# Altium schematic sheet JTAG2.SchDoc: Animated Archer Main PCB
size Letter; Author: John Eric Martin; Engineer: John Eric Martin; Organization: UCCS IEEE Robotics; Address1: 1420 Austin Bluffs Pkwy; Address2: Colorado Springs, CO 80918; DocumentNumber: JTAG2; Revision: 1; SheetNumber: 8; SheetTotal: 10; ProjectName: Animated Archer Quadcopter
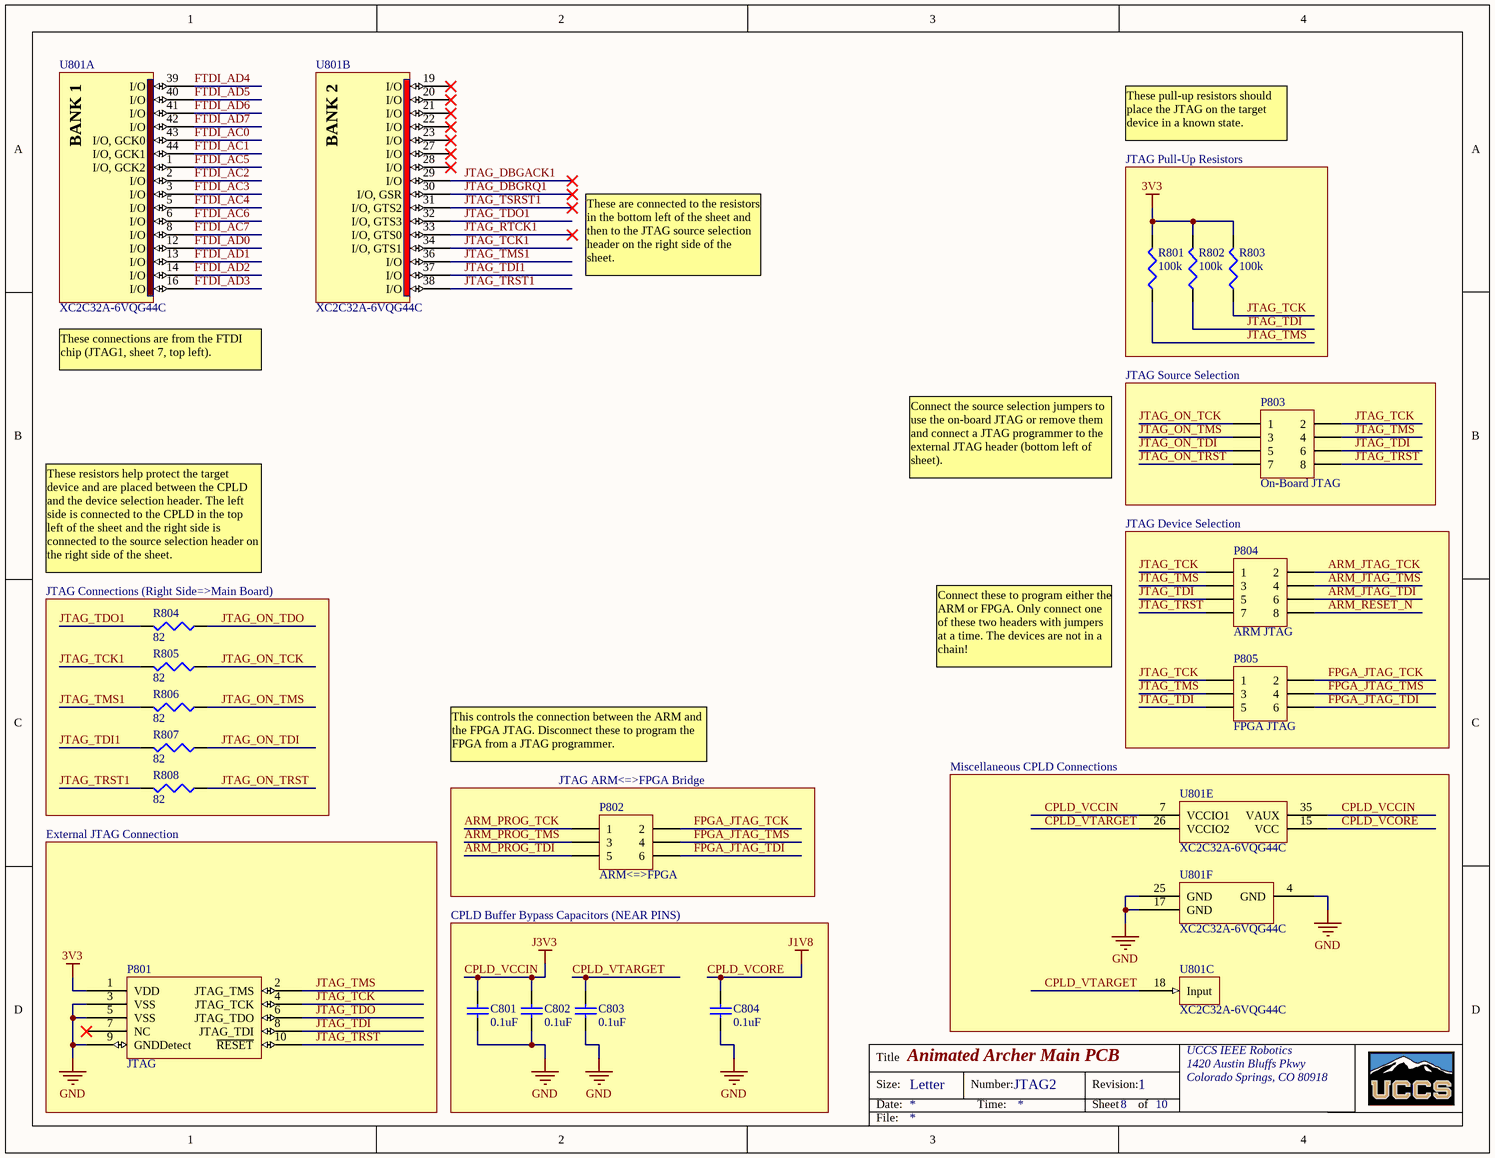
[diagram p0: JTAG2.SchDoc]

## Parts
C801  0.1uF  [1608[0603]]
C802  0.1uF  [1608[0603]]
C803  0.1uF  [1608[0603]]
C804  0.1uF  [1608[0603]]
P801  JTAG  [EZPORT]
P802  ARM<=>FPGA  [HDR2X3]
P803  On-Board JTAG  [HDR2X4]
P804  ARM JTAG  [HDR2X4]
P805  FPGA JTAG  [HDR2X3]
R801  value 100k  [J1-0603]  (hidden comment: Res3)
R802  value 100k  [J1-0603]  (hidden comment: Res3)
R803  value 100k  [J1-0603]  (hidden comment: Res3)
R804  value 82  [J1-0603]  (hidden comment: Res3)
R805  value 82  [J1-0603]  (hidden comment: Res3)
R806  value 82  [J1-0603]  (hidden comment: Res3)
R807  value 82  [J1-0603]  (hidden comment: Res3)
R808  value 82  [J1-0603]  (hidden comment: Res3)
U801  XC2C32A-6VQG44C  [VQG44_N]  (parts A,B,C,E,F of 6)

## Blocks framed on the sheet
JTAG Pull-Up Resistors: R801-R803
JTAG Source Selection: P803
JTAG Device Selection: P804 P805
JTAG Connections (Right Side=>Main Board): R804-R808
JTAG ARM<=>FPGA Bridge: P802
Miscellaneous CPLD Connections: U801
External JTAG Connection: P801
CPLD Buffer Bypass Capacitors (NEAR PINS): C801-C804

## Nets
3V3: P801.1(VDD) R801.2 R802.2 R803.2
CPLD_VCCIN: C801.2 C802.2 U801.7(VCCIO1) U801.35(VAUX)  [also labelled J3V3]
CPLD_VCORE: C804.2 U801.15(VCC)  [also labelled J1V8]
GND: C801.1 C802.1 C803.1 C804.1 P801.3(VSS) P801.5(VSS) P801.9(GNDDetect) U801.4(GND) U801.17(GND) U801.25(GND)
ARM_JTAG_TCK: P804.2
ARM_JTAG_TDI: P804.6
ARM_JTAG_TMS: P804.4
ARM_PROG_TCK: P802.1
ARM_PROG_TDI: P802.5
ARM_PROG_TMS: P802.3
ARM_RESET_N: P804.8
CPLD_VTARGET: C803.2 U801.18(Input) U801.26(VCCIO2)
FPGA_JTAG_TCK: P802.2 P805.2
FPGA_JTAG_TDI: P802.6 P805.6
FPGA_JTAG_TMS: P802.4 P805.4
FTDI_AC0: U801.43(I/O,_GCK0)
FTDI_AC1: U801.44(I/O,_GCK1)
FTDI_AC2: U801.2(I/O)
FTDI_AC3: U801.3(I/O)
FTDI_AC4: U801.5(I/O)
FTDI_AC5: U801.1(I/O,_GCK2)
FTDI_AC6: U801.6(I/O)
FTDI_AC7: U801.8(I/O)
FTDI_AD0: U801.12(I/O)
FTDI_AD1: U801.13(I/O)
FTDI_AD2: U801.14(I/O)
FTDI_AD3: U801.16(I/O)
FTDI_AD4: U801.39(I/O)
FTDI_AD5: U801.40(I/O)
FTDI_AD6: U801.41(I/O)
FTDI_AD7: U801.42(I/O)
JTAG_DBGACK1: U801.29(I/O)
JTAG_DBGRQ1: U801.30(I/O,_GSR)
JTAG_ON_TCK: P803.1 R805.1
JTAG_ON_TDI: P803.5 R807.1
JTAG_ON_TDO: R804.1
JTAG_ON_TMS: P803.3 R806.1
JTAG_ON_TRST: P803.7 R808.1
JTAG_RTCK1: U801.33(I/O,_GTS0)
JTAG_TCK: P801.4(JTAG_TCK) P803.2 P804.1 P805.1 R803.1
JTAG_TCK1: R805.2 U801.34(I/O,_GTS1)
JTAG_TDI: P801.8(JTAG_TDI) P803.6 P804.5 P805.5 R802.1
JTAG_TDI1: R807.2 U801.37(I/O)
JTAG_TDO: P801.6(JTAG_TDO)
JTAG_TDO1: R804.2 U801.32(I/O,_GTS3)
JTAG_TMS: P801.2(JTAG_TMS) P803.4 P804.3 P805.3 R801.1
JTAG_TMS1: R806.2 U801.36(I/O)
JTAG_TRST: P801.10(~{RESET}) P803.8 P804.7
JTAG_TRST1: R808.2 U801.38(I/O)
JTAG_TSRST1: U801.31(I/O,_GTS2)

Not connected (* = marked no-connect by the designer): P801 7(NC)*; U801 19(I/O)* 20(I/O)* 21(I/O)* 22(I/O)* 23(I/O)* 27(I/O)* 28(I/O)*

## Notes on the sheet
- These pull-up resistors should place the JTAG on the target device in a known state.
- These are connected to the resistors in the bottom left of the sheet and then to the JTAG source selection header on the right side of the sheet.
- (near U801) These connections are from the FTDI chip (JTAG1, sheet 7, top left).
- Connect the source selection jumpers to use the on-board JTAG or remove them and connect a JTAG programmer to the external JTAG header (bottom left of sheet).
- These resistors help protect the target device and are placed between the CPLD and the device selection header. The left side is connected to the CPLD in the top left of the sheet and the right side is connected to the source selection header on the right side of the sheet.
- Connect these to program either the ARM or FPGA. Only connect one of these two headers with jumpers at a time. The devices are not in a chain!
- This controls the connection between the ARM and the FPGA JTAG. Disconnect these to program the FPGA from a JTAG programmer.
- Title
- Size:
- Date:
- Letter
- Number:
- Time:
- Revision:
- Sheet
- of
- File:
- (in symbol XC2C32A-6VQG44C, part A) BANK 1
- (in symbol XC2C32A-6VQG44C, part B) BANK 2

## Library data of the parts
C801-C804 = Cap Semi: Capacitor (Semiconductor SIM Model); Published: 8-Jun-2000; LatestRevisionDate: 29-May-2009; LatestRevisionNote: IPC-7351 Footprint Added.; PackageReference: C1206; Publisher: Altium Limited; PackageDescription: Chip Capacitor; Value: 0.1uF
P801 = Debug Interface: 10-pin Freescale Debug Interface; LatestRevisionDate: 17-Jul-2002; LatestRevisionNote: Re-released for DXP Platform.; Publisher: Altium Limited
P802 P805 = Header 3X2: Header, 3-Pin, Dual row; LatestRevisionDate: 17-Jul-2002; LatestRevisionNote: Re-released for DXP Platform.; Publisher: Altium Limited
P803 P804 = Header 4X2: Header, 4-Pin, Dual row; LatestRevisionDate: 17-Jul-2002; LatestRevisionNote: Re-released for DXP Platform.; Publisher: Altium Limited
R801-R808 = Res3: Resistor; Published: 8-Jun-2000; LatestRevisionDate: 29-May-2009; LatestRevisionNote: IPC-7351 Footprint Added.; PackageReference: J1-0603; Publisher: Altium Limited; PackageDescription: Chip Resistor
U801 = XC2C32A-6VQG44C: CoolRunner-II 1.8V, 32 Macrocell CPLD, 33 User I/Os, 44-Pin VQFP, Commercial Grade, Pb-Free; Published: 4-Mar-2005; LatestRevisionDate: 30-Oct-2009; LatestRevisionNote: Updated to datasheet version 3.1 Sep-2008.; DatasheetVersion: ver2.1, Nov-2008; PackageVersion: ver1.2, Jun-2004; PackageReference: VQG44; Publisher: Altium Limited; PackageDescription: 44-Pin Very Thin Quad Flat Pack (VQG44) - Pb-Free; Supplier 1: Digi-Key; Supplier Part Number 1: 122-1404-ND; Code_JEDEC: MS-026-ACB; ComponentLink1Description: XC2C32A Datasheet; ComponentLink1URL: http://www.xilinx.com/support/documentation/data_sheets/ds310.pdf; ComponentLink2Description: Discontinuation Notice; ComponentLink2URL: http://www.xilinx.com/support/documentation/customer_notices/xcn07022.pdf; ComponentLink3Description: VQG44 Package Drawing; ComponentLink3URL: http://www.xilinx.com/support/documentation/package_specs/vq44.pdf; ComponentLink4Description: CoolRunner-II Documents; ComponentLink4URL: http://www.xilinx.com/support/documentation/coolrunner-ii.htm; ComponentLink5Description: Xilinx.com Home; ComponentLink5URL: http://www.xilinx.com